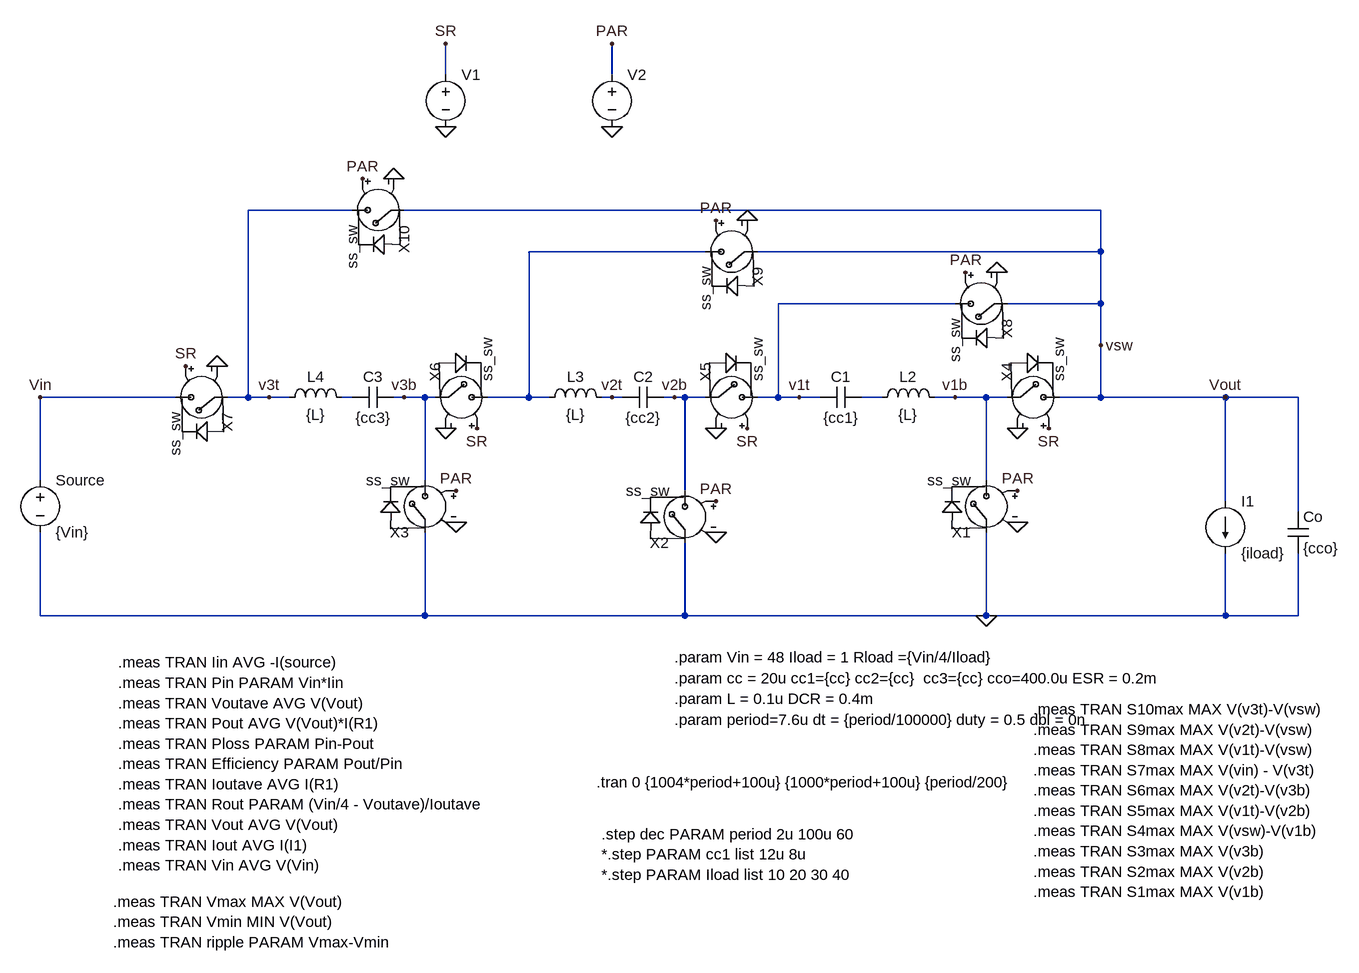
[diagram p0: schematic 4to1_distributed.asc]
4to1_distributed.asc, the LTspice schematic file:
Version 4
SHEET 1 2036 1112
WIRE -240 -480 -240 -528
WIRE 16 -480 16 -528
WIRE -384 -272 -544 -272
WIRE 768 -272 -304 -272
WIRE 160 -208 -112 -208
WIRE 768 -208 768 -272
WIRE 768 -208 240 -208
WIRE 544 -128 272 -128
WIRE 768 -128 768 -208
WIRE 768 -128 624 -128
WIRE 768 -64 768 -128
WIRE -656 16 -864 16
WIRE -544 16 -544 -272
WIRE -544 16 -576 16
WIRE -512 16 -544 16
WIRE -480 16 -512 16
WIRE -384 16 -400 16
WIRE -304 16 -320 16
WIRE -272 16 -304 16
WIRE -256 16 -272 16
WIRE -112 16 -112 -208
WIRE -112 16 -176 16
WIRE -80 16 -112 16
WIRE 16 16 0 16
WIRE 32 16 16 16
WIRE 112 16 96 16
WIRE 128 16 112 16
WIRE 160 16 128 16
WIRE 272 16 272 -128
WIRE 272 16 240 16
WIRE 304 16 272 16
WIRE 336 16 304 16
WIRE 432 16 400 16
WIRE 544 16 512 16
WIRE 592 16 544 16
WIRE 624 16 592 16
WIRE 768 16 768 -64
WIRE 768 16 704 16
WIRE 960 16 768 16
WIRE 1072 16 960 16
WIRE -864 144 -864 16
WIRE -272 144 -272 16
WIRE 592 144 592 16
WIRE 128 160 128 16
WIRE 960 176 960 16
WIRE 1072 192 1072 16
WIRE -864 352 -864 224
WIRE -272 352 -272 224
WIRE -272 352 -864 352
WIRE 128 352 128 240
WIRE 128 352 -272 352
WIRE 592 352 592 224
WIRE 592 352 128 352
WIRE 960 352 960 256
WIRE 960 352 592 352
WIRE 1072 352 1072 256
WIRE 1072 352 960 352
FLAG 16 -400 0
FLAG 16 -528 PAR
FLAG 592 352 0
FLAG 176 64 0
FLAG 640 64 0
FLAG 640 208 0
FLAG 608 -176 0
FLAG 560 -176 PAR
FLAG 640 160 PAR
FLAG 224 64 SR
FLAG 688 64 SR
FLAG -864 16 Vin
FLAG 16 16 v2t
FLAG 304 16 v1t
FLAG 960 16 Vout
FLAG -192 64 SR
FLAG 176 -256 PAR
FLAG 176 176 PAR
FLAG -240 64 0
FLAG 224 -256 0
FLAG 176 224 0
FLAG 112 16 v2b
FLAG -368 -320 PAR
FLAG -320 -320 0
FLAG -592 -32 0
FLAG -640 -32 SR
FLAG -224 160 PAR
FLAG -224 208 0
FLAG -512 16 v3t
FLAG -304 16 v3b
FLAG 544 16 v1b
FLAG -240 -400 0
FLAG -240 -528 SR
FLAG 768 -64 vsw
SYMBOL voltage 16 -496 R0
WINDOW 123 0 0 Left 2
WINDOW 39 0 0 Left 2
WINDOW 3 24 96 Invisible 2
SYMATTR Value PULSE(0 1 {period*duty+dt*0.65} 1p 1p {(period-dt)*(1-duty)-dt} {period})
SYMATTR InstName V2
SYMBOL voltage -864 128 R0
WINDOW 123 0 0 Left 2
WINDOW 39 0 0 Left 2
SYMATTR InstName Source
SYMATTR Value {Vin}
SYMBOL cap 336 32 R270
WINDOW 0 32 32 VTop 2
WINDOW 3 0 32 VBottom 2
SYMATTR InstName C1
SYMATTR Value {cc1}
SYMATTR SpiceLine Rser = {ESR} ic = {Vin/4}
SYMBOL cap 1056 192 R0
SYMATTR InstName Co
SYMATTR Value {cco}
SYMATTR Value2 Rser = {ESR} ic = {Vin/4}
SYMBOL cap 32 32 R270
WINDOW 0 32 32 VTop 2
WINDOW 3 0 32 VBottom 2
SYMATTR InstName C2
SYMATTR Value {cc2}
SYMATTR SpiceLine Rser = {ESR} ic = {Vin/4}
SYMBOL cap -384 32 R270
WINDOW 0 32 32 VTop 2
WINDOW 3 0 32 VBottom 2
SYMATTR InstName C3
SYMATTR Value {cc3}
SYMATTR SpiceLine Rser = {ESR} ic = {Vin/4}
SYMBOL voltage -240 -496 R0
WINDOW 123 0 0 Left 2
WINDOW 39 0 0 Left 2
WINDOW 3 24 96 Invisible 2
SYMATTR Value PULSE(0 1 0 1p 1p {(period-dt)*duty+dbl} {period})   )
SYMATTR InstName V1
SYMBOL ss_sw 592 240 R180
SYMATTR SpiceLine ron = 5m
SYMATTR InstName X1
SYMBOL ss_sw 128 256 R180
SYMATTR SpiceLine ron = 5m
SYMATTR InstName X2
SYMBOL ss_sw -272 240 R180
SYMATTR InstName X3
SYMATTR SpiceLine ron = 5m
SYMBOL ss_sw 608 16 R270
SYMATTR SpiceLine ron = 5m
SYMATTR InstName X4
SYMBOL ss_sw 144 16 R270
SYMATTR InstName X5
SYMATTR SpiceLine ron = 5m
SYMBOL ss_sw -272 16 R270
SYMATTR SpiceLine ron = 5m
SYMATTR InstName X6
SYMBOL ss_sw -560 16 R90
SYMATTR SpiceLine ron = 5m
SYMATTR InstName X7
SYMBOL ss_sw 640 -128 R90
SYMATTR InstName X8
SYMATTR SpiceLine ron = 5m
SYMBOL ss_sw 256 -208 R90
SYMATTR InstName X9
SYMATTR SpiceLine ron = 5m
SYMBOL ss_sw -288 -272 R90
SYMATTR InstName X10
SYMATTR SpiceLine ron = 5m
SYMBOL ind 416 32 R270
WINDOW 0 32 56 VTop 2
WINDOW 3 5 56 VBottom 2
SYMATTR InstName L2
SYMATTR Value {L}
SYMBOL ind -96 32 R270
WINDOW 0 32 56 VTop 2
WINDOW 3 5 56 VBottom 2
SYMATTR InstName L3
SYMATTR Value {L}
SYMBOL ind -496 32 R270
WINDOW 0 32 56 VTop 2
WINDOW 3 5 56 VBottom 2
SYMATTR InstName L4
SYMATTR Value {L}
SYMBOL current 960 176 R0
WINDOW 123 0 0 Left 2
WINDOW 39 0 0 Left 2
SYMATTR InstName I1
SYMATTR Value {iload}
TEXT -8 608 Left 2 !.tran 0 {1004*period+100u} {1000*period+100u} {period/200}
TEXT -744 424 Left 2 !.meas TRAN Iin AVG -I(source)\n.meas TRAN Pin PARAM Vin*Iin\n.meas TRAN Voutave AVG V(Vout)\n.meas TRAN Pout AVG V(Vout)*I(R1)\n.meas TRAN Ploss PARAM Pin-Pout\n.meas TRAN Efficiency PARAM Pout/Pin\n.meas TRAN Ioutave AVG I(R1)\n.meas TRAN Rout PARAM (Vin/4 - Voutave)/Ioutave\n.meas TRAN Vout AVG V(Vout)\n.meas TRAN Iout AVG I(I1)\n.meas TRAN Vin AVG V(Vin)
TEXT 112 448 Left 2 !.param cc = 20u cc1={cc} cc2={cc}  cc3={cc} cco=400.0u ESR = 0.2m
TEXT 0 688 Left 2 !.step dec PARAM period 2u 100u 60\n*.step PARAM cc1 list 12u 8u\n*.step PARAM Iload list 10 20 30 40
TEXT -752 792 Left 2 !.meas TRAN Vmax MAX V(Vout)\n.meas TRAN Vmin MIN V(Vout)\n.meas TRAN ripple PARAM Vmax-Vmin
TEXT 112 416 Left 2 !.param Vin = 48 Iload = 1 Rload ={Vin/4/Iload}
TEXT 112 512 Left 2 !.param period=7.6u dt = {period/100000} duty = 0.5 dbl = 0n
TEXT 112 480 Left 2 !.param L = 0.1u DCR = 0.4m
TEXT 664 496 Left 2 !.meas TRAN S10max MAX V(v3t)-V(vsw)\n.meas TRAN S9max MAX V(v2t)-V(vsw)\n.meas TRAN S8max MAX V(v1t)-V(vsw)\n.meas TRAN S7max MAX V(vin) - V(v3t)\n.meas TRAN S6max MAX V(v2t)-V(v3b)\n.meas TRAN S5max MAX V(v1t)-V(v2b)\n.meas TRAN S4max MAX V(vsw)-V(v1b)\n.meas TRAN S3max MAX V(v3b)\n.meas TRAN S2max MAX V(v2b)\n.meas TRAN S1max MAX V(v1b)

The netlist it stands for:
* 4to1_distributed.asc
V2 PAR 0 PULSE(0 1 {period*duty+dt*0.65} 1p 1p {(period-dt)*(1-duty)-dt} {period})
V§Source Vin 0 {Vin}
C1 v1t N003 {cc1} Rser = {ESR} ic = {Vin/4}
Co vsw 0 {cco} Rser = {ESR} ic = {Vin/4}
C2 v2t v2b {cc2} Rser = {ESR} ic = {Vin/4}
C3 N002 v3b {cc3} Rser = {ESR} ic = {Vin/4}
V1 SR 0 PULSE(0 1 0 1p 1p {(period-dt)*duty+dbl} {period})   )
XX1 0 v1b PAR 0 ss_sw ron = 5m  ; pins A B NC+ NC-
XX2 0 v2b PAR 0 ss_sw ron = 5m  ; pins A B NC+ NC-
XX3 0 v3b PAR 0 ss_sw ron = 5m  ; pins A B NC+ NC-
XX4 v1b vsw SR 0 ss_sw ron = 5m  ; pins A B NC+ NC-
XX5 v2b v1t SR 0 ss_sw ron = 5m  ; pins A B NC+ NC-
XX6 v3b N001 SR 0 ss_sw ron = 5m  ; pins A B NC+ NC-
XX7 v3t Vin SR 0 ss_sw ron = 5m  ; pins A B NC+ NC-
XX8 vsw v1t PAR 0 ss_sw ron = 5m  ; pins A B NC+ NC-
XX9 vsw N001 PAR 0 ss_sw ron = 5m  ; pins A B NC+ NC-
XX10 vsw v3t PAR 0 ss_sw ron = 5m  ; pins A B NC+ NC-
L2 N003 v1b {L}
L3 N001 v2t {L}
L4 v3t N002 {L}
I1 vsw 0 {iload}
.tran 0 {1004*period+100u} {1000*period+100u} {period/200}
.meas TRAN Iin AVG -I(source)
.meas TRAN Pin PARAM Vin*Iin
.meas TRAN Voutave AVG V(Vout)
.meas TRAN Pout AVG V(Vout)*I(R1)
.meas TRAN Ploss PARAM Pin-Pout
.meas TRAN Efficiency PARAM Pout/Pin
.meas TRAN Ioutave AVG I(R1)
.meas TRAN Rout PARAM (Vin/4 - Voutave)/Ioutave
.meas TRAN Vout AVG V(Vout)
.meas TRAN Iout AVG I(I1)
.meas TRAN Vin AVG V(Vin)
.param cc = 20u cc1={cc} cc2={cc}  cc3={cc} cco=400.0u ESR = 0.2m
.step dec PARAM period 2u 100u 60
*.step PARAM cc1 list 12u 8u
*.step PARAM Iload list 10 20 30 40
.meas TRAN Vmax MAX V(Vout)
.meas TRAN Vmin MIN V(Vout)
.meas TRAN ripple PARAM Vmax-Vmin
.param Vin = 48 Iload = 1 Rload ={Vin/4/Iload}
.param period=7.6u dt = {period/100000} duty = 0.5 dbl = 0n
.param L = 0.1u DCR = 0.4m
.meas TRAN S10max MAX V(v3t)-V(vsw)
.meas TRAN S9max MAX V(v2t)-V(vsw)
.meas TRAN S8max MAX V(v1t)-V(vsw)
.meas TRAN S7max MAX V(vin) - V(v3t)
.meas TRAN S6max MAX V(v2t)-V(v3b)
.meas TRAN S5max MAX V(v1t)-V(v2b)
.meas TRAN S4max MAX V(vsw)-V(v1b)
.meas TRAN S3max MAX V(v3b)
.meas TRAN S2max MAX V(v2b)
.meas TRAN S1max MAX V(v1b)
.backanno
.end